# EAGLE design C64_PSU_global (EAGLE 9.5.2)
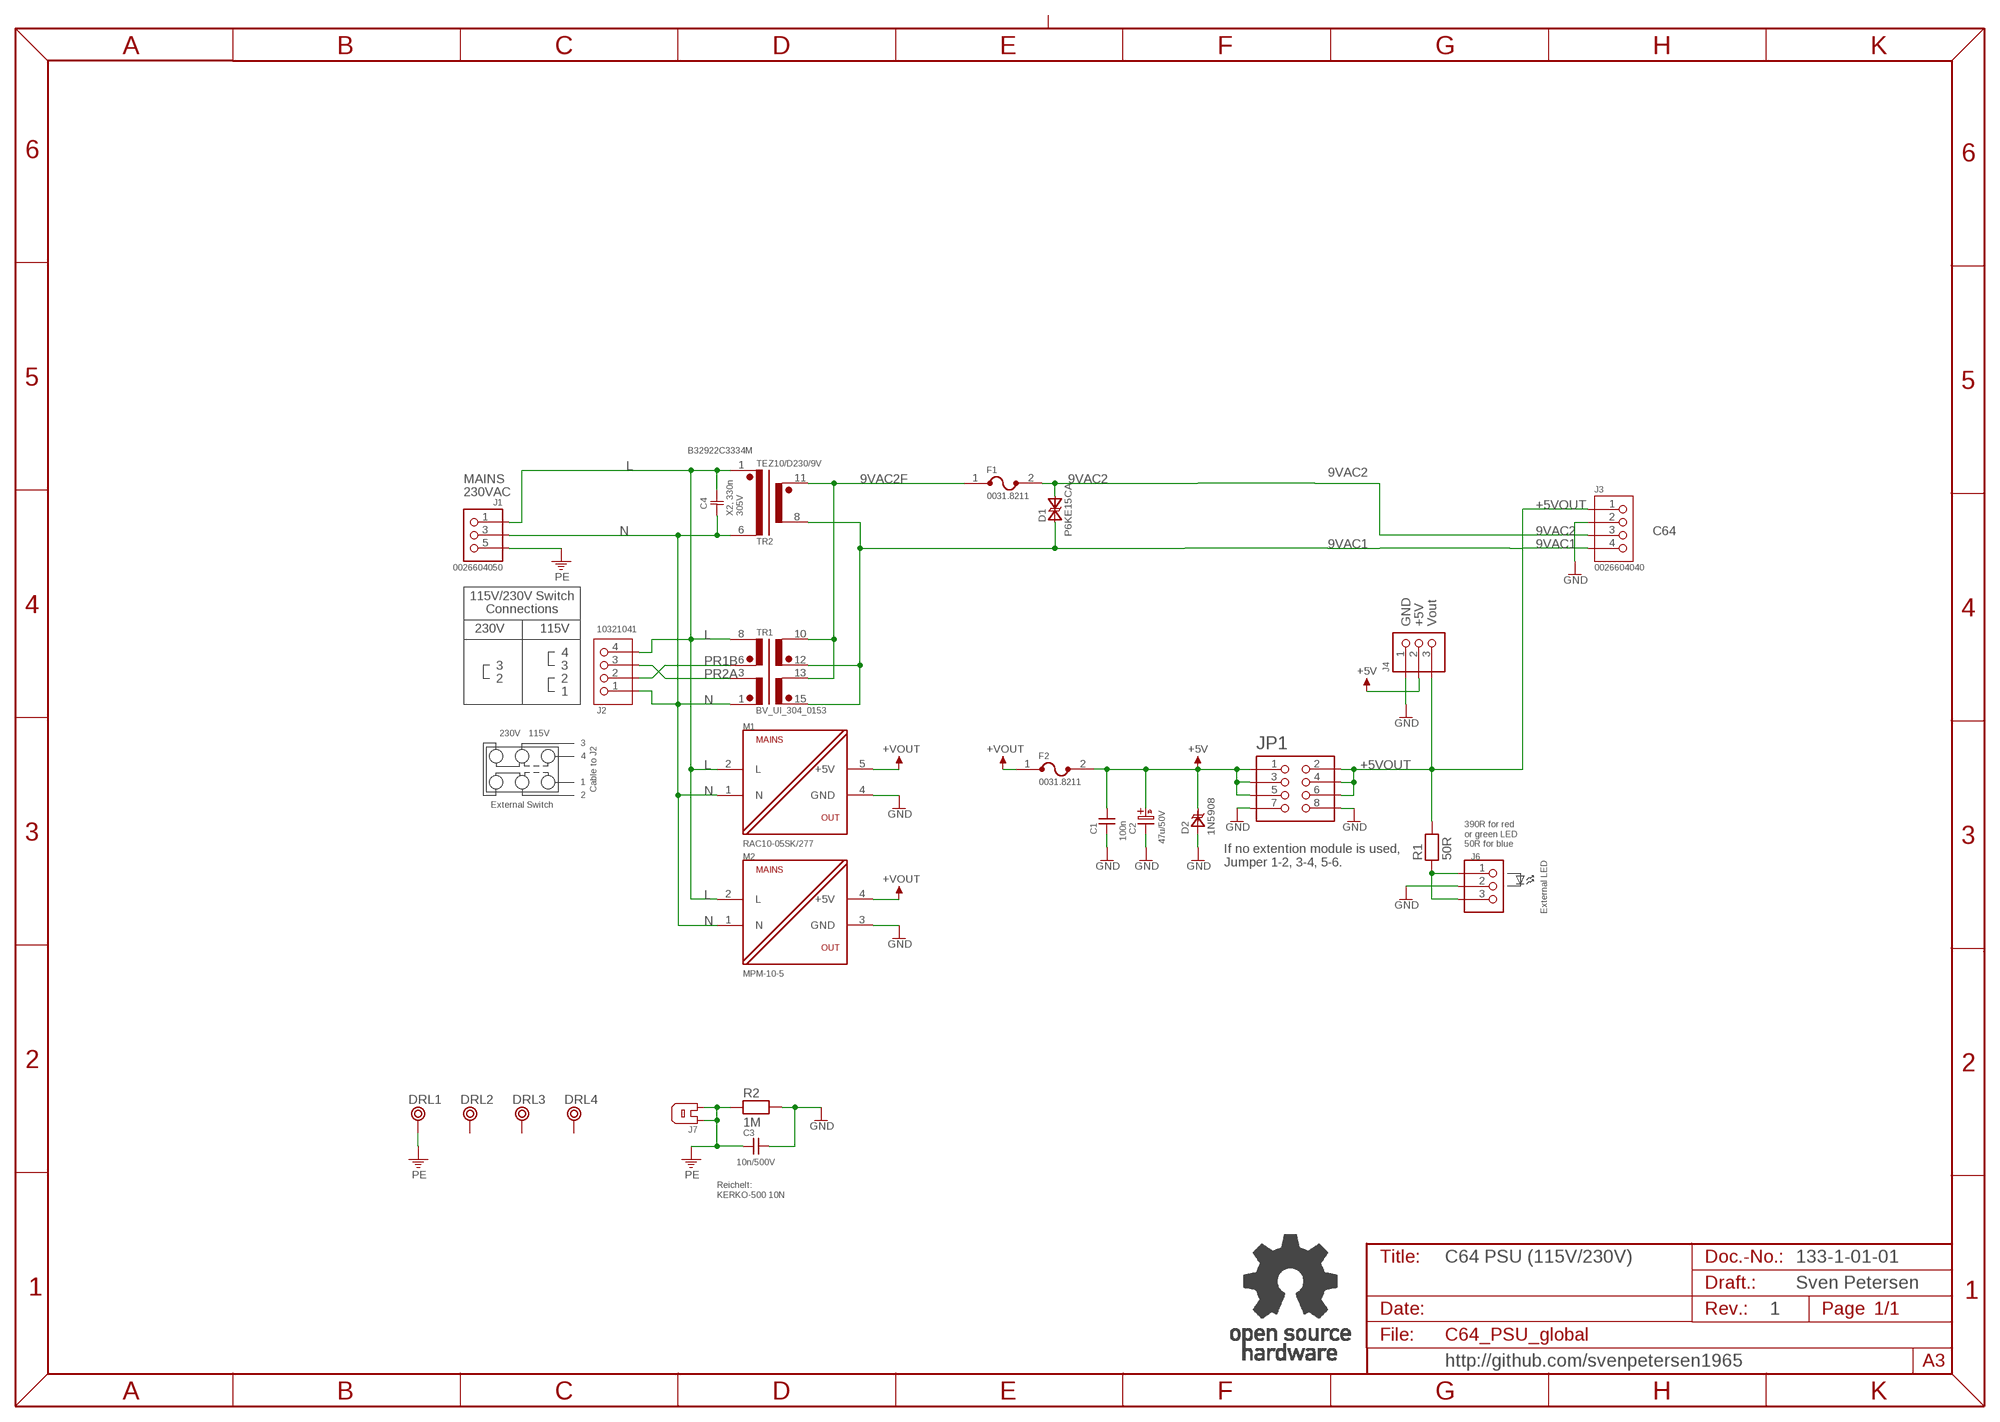
[diagram p0: schematic, sheet 1]

## Parts
C1  100n  CAP01  [C-2,5]
C2  47u/50V  C07/2,5  [C07/2,5]
C3  10n/500V  CAP02  [C-5]
C4  B32922C3334M  X2--RM15-18X8  [C-18X8-RM15]
D1  P6KE15CA  [CB417NP]
D2  1N5908  [CB429]
DRL1  BOHR3,5OR  [BOHR3,5_OHNE_RESTRICT]
DRL2  BOHR3,5  [BOHR3,5]
DRL3  BOHR3,5  [BOHR3,5]
DRL4  BOHR3,5  [BOHR3,5]
F1  0031.8211  [0031.8211]
F2  0031.8211  [0031.8211]
J1  0026604050  0026604050MOD  [SPOX_3.96_5P3]
J2  10321041  [SPOX_5.08_4P]
J3  0026604040  [SPOX_3.96_4P]
J4  6410-3P  [6410-3P]
J6  PINHD-1X3  [1X03]
J7  FLA6,3  [FLA6,3]
JP1  PINHD-2X4  [2X04]
M1  RAC10-05SK/277  [RAC10-K/277]
M2  MPM-10-5  [MPM10]
R1  50R  RES04  [R-10]
R2  1M  RES04  [R-10]
TR1  BV_UI_304_0153  [UI30]
TR2  TEZ10/D230/9V  [TEZ10]
U$25  OPEN_SOURCE_HW  [OPENHW]

## Nets
9VAC1: D1.A(A1) J3.4 TR1.12(SEC1B) TR1.15(SEC2B) TR2.8(SEC11)
9VAC2: D1.K(A2) F1.2 J3.3
9VAC2F: F1.1 TR1.10(SEC1A) TR1.13(SEC2A) TR2.11(SEC12)
+5V: C1.2 C2.A(+) D2.K F2.2 J4.2 JP1.1 JP1.3 JP1.5
+5VOUT: J3.1 J4.3 JP1.2 JP1.4 JP1.6 R1.2
+VOUT: F2.1 M1.5(+5V) M2.4(+5V)
GND: C1.1 C2.K(-) C3.2 D2.A J3.2 J4.1 J6.2 JP1.7 JP1.8 M1.4(GND) M2.3(GND) R2.2
L [mains]: C4.2 J1.1 J2.4 M1.2(L) M2.2(L) TR1.8(PRI1A) TR2.1(PRI2)
N [mains]: C4.1 J1.3 J2.1 M1.1(N) M2.1(N) TR1.1(PRI2B) TR2.6(PRI1)
N$2: J6.1 J6.3 R1.1
PE [PE]: C3.1 DRL1.P$1 J1.5 J7.1 J7.2 R2.1
PR1B [115V]: J2.2 TR1.6(PRI1B)
PR2A [115V]: J2.3 TR1.3(PRI2A)
Unconnected: DRL2.P$1 DRL3.P$1 DRL4.P$1

## Notes on the sheet
- MAINS
- 230VAC
- X2, 330n
  305V
- C64
- 115V/230V Switch
- Connections
- GND | +5V | Vout
- 230V | 115V
- 4
- 3 | 3
- 2 | 2
- 1
- 230V | 115V
- 3
- 4
- Cable to J2
- 1
- 2
- External Switch
- 390R for red
  or green LED
  50R for blue
- If no extention module is used,
  Jumper 1-2, 3-4, 5-6.
- External LED
- Reichelt:
  KERKO-500 10N
- C64 PSU (115V/230V) | 133-1-01-01
- Sven Petersen
- 1
- http://github.com/svenpetersen1965

## Library data of the parts
C1 = DISCRETE:CAP01
C2 = ELCO:C07/2,5
C3 = DISCRETE:CAP02
C4 = Epcos_EMV:X2-*: X2-Kondensatoren
D1 = ST:P6KE15CA
D2 = ST:1N5908
DRL1-DRL4 = Mech_Bohr:BOHR3,5
F1 F2 = Schurter:0031.8211
J1 = MOLEX:0026604050MOD
J2 = MOLEX:10321041
J3 = MOLEX:0026604040
J4 = MOLEX:6410-3P: 6410/22-27-2031
J6 = PINHEAD:PINHD-1X3
J7 = Connect:FLA6,3
JP1 = PINHEAD:PINHD-2X4
M1 = Recom:RAC10-05SK/277
M2 = MeanWell:MPM-10-5
R1 R2 = DISCRETE:RES04
TR1 = Hahn:BV_UI_304_0153
TR2 = Breve Tufvassons:TEZ10/D230/9V: tme.eu: TEZ10/D/9V
U$25 = Logo:OPEN_SOURCE_HW

## Net classes
0 default: clearance 0.152 mm
1 mains: width 1.016 mm, drill 0.6 mm, clearance 1 mm to class 0, clearance 5 mm
2 PE: width 1.016 mm, drill 0.6 mm, clearance 1.5 mm to class 0, clearance 5 mm to class 1
3 115V: width 1.016 mm, drill 0.6 mm, clearance 1 mm to class 0, clearance 2.5 mm to class 1, clearance 5 mm to class 2, clearance 2.5 mm

## Board
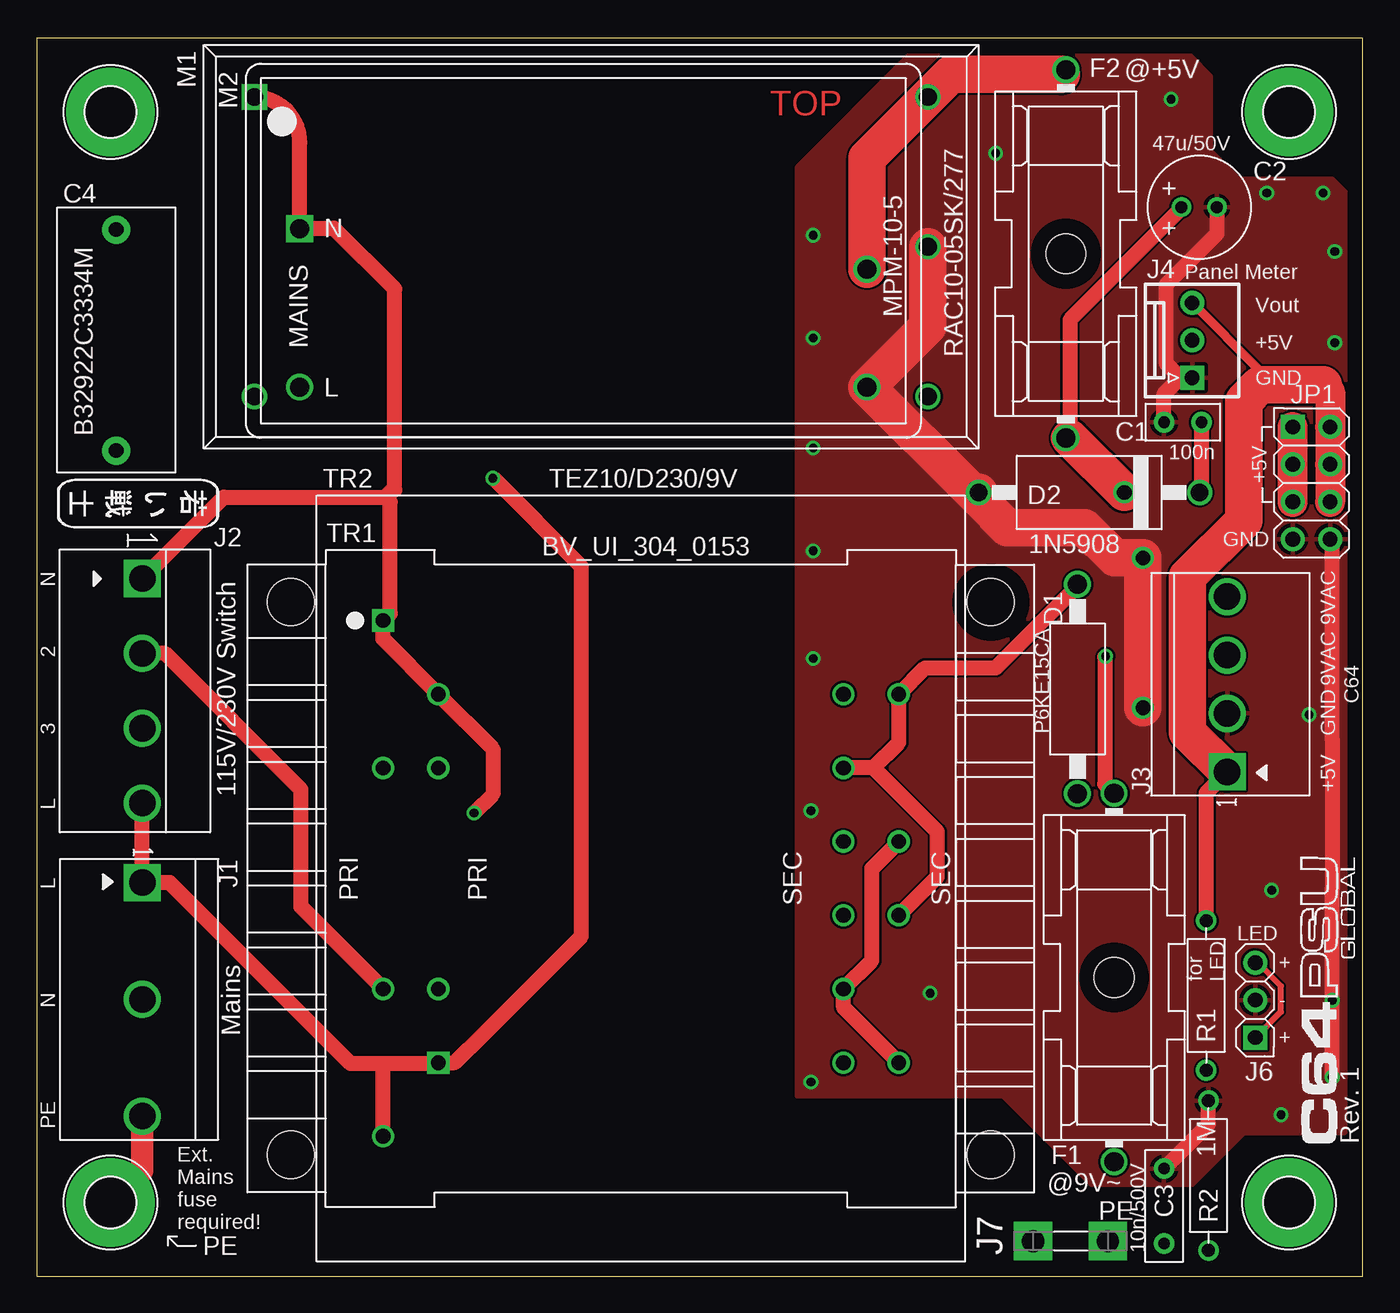
[diagram p1: board, top side]
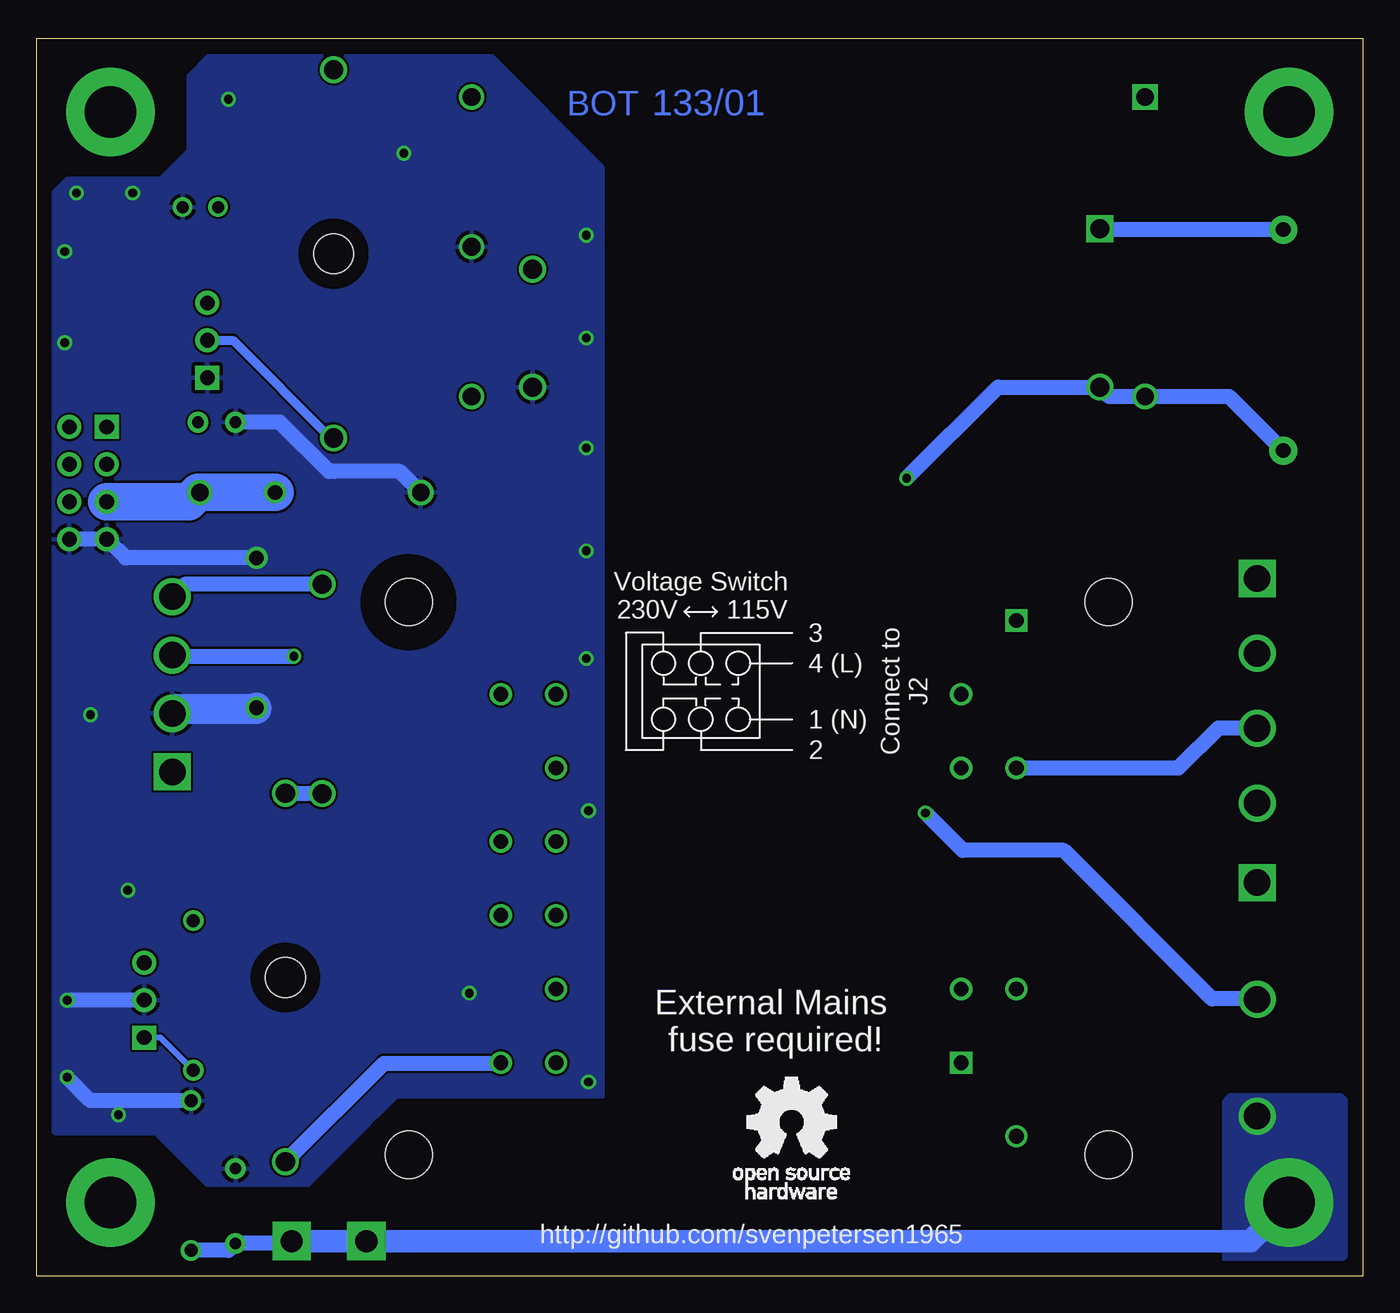
[diagram p2: board, bottom side, seen from below]

Size 90 x 84 mm. Coordinates in mm from the lower left corner, seen from the top.
Outline: 0,0 90,0 90,84 0,84 0,0
Copper layers (1*16): Top 0.035mm / dielectric 1.5mm / Bottom 0.035mm
Design rules "default *": minimum track width 6mil, minimum drill 0.35mm, track to track 6mil, track to pad 6mil, pad to pad 6mil, via to via 6mil, smd to smd 6mil, copper to edge 40mil, drill to drill 6mil, minimum pad ring 10mil, minimum via ring 8mil, stop-mask expansion 4mil, vias tented up to drill 0mil, thermal gap 10mil
tRestrict: 4 lines
bRestrict: 3 lines

### Footprints (pad centres in the part's own frame; a part is rotated, then mirrored left to right if it is on the bottom)
C-2,5 = drill 0.8 pad 1.397: 1 -1.27,0; 2 1.27,0
C07/2,5 = drill 0.813 pad 1.27: A -1.202,0; K 1.202,0
C-5 = drill 0.8 pad 1.397: 1 -2.54,0; 2 2.54,0
C-18X8-RM15 = drill 1 pad 1.905: 1 -7.5,0; 2 7.5,0
CB417NP = drill 1.3: A -7.1,0; K 7.1,0
CB429 = drill 1.2: A -7.5,0; K 7.5,0
BOHR3,5_OHNE_RESTRICT = drill 3.5 pad 6: P$1 0,0
BOHR3,5 = drill 3.5 pad 6: P$1 0,0
0031.8211 = drill 1.3: 1 -12.5,0; 2 12.5,0 | hole 2.7: 0,0
SPOX_3.96_5P3 = drill 1.8 square: 1 -7.92,0 | drill 1.8: 3 0,0; 5 7.92,0
SPOX_5.08_4P = drill 1.8 square: 1 -7.62,0 | drill 1.8: 2 -2.54,0; 3 2.54,0; 4 7.62,0
SPOX_3.96_4P = drill 1.8 square: 1 -5.94,0 | drill 1.8: 2 -1.98,0; 3 1.98,0; 4 5.94,0
6410-3P = drill 1 pad 1.626 square: 1 -2.54,0 | drill 1 pad 1.626: 2 0,0; 3 2.54,0
1X03 = drill 1 pad 1.626 square: 1 -2.54,0 | drill 1 pad 1.626: 2 0,0; 3 2.54,0
FLA6,3 = drill 1.5 pad 2.591 square: 1 -2.54,0; 2 2.54,0
2X04 = drill 1 pad 1.626 square: 1 -3.81,-1.27 | drill 1 pad 1.626: 2 -3.81,1.27; 3 -1.27,-1.27; 4 -1.27,1.27; 5 1.27,-1.27; 6 1.27,1.27; 7 3.81,-1.27; 8 3.81,1.27
RAC10-K/277 = drill 1.2 square: 1 -22.86,10.16 | drill 1.2: 2 -22.86,-10.16; 3 22.86,-10.16; 4 22.86,0; 5 22.86,10.16
MPM10 = drill 1.3 square: 1 -19.25,1.5 | drill 1.3: 2 -19.25,-9.25; 3 19.25,-9.25; 4 19.25,-1.25
R-10 = drill 0.889 pad 1.397: 1 -5.08,0; 2 5.08,0
UI30 = drill 1 square: 1 17.5,17.5 | drill 1: 3 7.5,17.5; 6 -7.5,17.5; 8 -17.5,17.5; 10 -12.5,-17.5; 12 -2.5,-17.5; 13 2.5,-17.5; 15 12.5,-17.5 | hole 3.2: 18.75,-23.75; 18.75,23.75; -18.75,-23.75; -18.75,23.75
TEZ10 = drill 1 square: 1 -12.5,13.75 | drill 1: 2 -7.5,13.75; 5 7.5,13.75; 6 12.5,13.75; 7 12.5,-13.75; 8 7.5,-13.75; 9 2.5,-13.75; 10 -2.5,-13.75; 11 -7.5,-13.75; 12 -12.5,-13.75

### Placement (x,y rotation side)
C1  77.79,57.94 0 top
C2  78.9,72.55 0 top
C3  76.52,4.76 90 top
C4  5.39,63.52 270 top
D1  70.64,39.85 270 top
D2  71.44,53.18 0 top
DRL1  5,5 0 top
DRL2  85,5 0 top
DRL3  85,79 0 top
DRL4  5,79 0 top
F1  73.13,20.26 90 top
F2  69.85,69.37 270 top
J1  7.16,18.78 270 top
J2  7.16,39.72 270 top
J3  80.8,40.16 90 top
J4  78.42,63.5 90 top
J6  82.71,18.73 90 top
J7  70.17,2.38 0 top
JP1  86.52,53.82 270 top
M1  37.63,69.85 0 top
M2  37.1,69.58 0 top
R1  79.38,19.05 90 top
R2  79.53,6.83 90 top
TR1  41.01,26.99 90 top
TR2  41.01,26.99 90 top
U$14  [PCB-TITLE/]  0,96.68 0 top  (outside the outline)
U$20  [SVEN_TAG]  6.99,52.39 270 top
U$22  [C64_PSU_GLOBAL]  89.5,9 90 top
U$23  [2LAYER]  49.75,78.75 0 top
U$25  42.7,5.24 0 bottom

### Tracks (layer width: path | path; a pad name or v marks a point on that pad's centre or on a via)
9VAC1
  Top 1.016: TR1.12 61.12,27.1 61.12,30.16 56.79,34.49 | 56.79,34.49 TR2.8 | 56.79,34.49 58.51,36.2 TR1.15 60.29,41.27 65.09,41.27 70.64,46.83 D1.A
  Bottom 1.016: D1.A 79.96,46.95 J3.4
9VAC2  (via drill 0.6)
  Top 1.016: v72.55,42.07 72.49,42.01 72.49,33.4 F1.2
  Bottom 1.016: D1.K 73.11,32.75 F1.2 | J3.3 80.73,42.07 v72.55,42.07
9VAC2F
  Top 1.016: TR1.10 54.76,18.24 TR2.11 56.67,21.41 56.67,27.66 TR1.13
  Bottom 1.016: F1.1 66.44,14.45 58.55,14.45 TR1.10
+5V  (via drill 1)
  Top 1.016: 70.13,56.87 70.13,64.89 77.7,72.46 C2.A | C1.2 79.06,53.3 D2.K
  Top 2.032: 70.13,56.87 F2.2 | JP1.5 JP1.3 JP1.1
  Top 2.54: v73.82,53.18 70.13,56.87
  Bottom 0.61: J4.2 76.68,63.5 70.05,56.87 F2.2
  Bottom 2.54: v73.82,53.18 D2.K 79.06,53.18 79.69,52.55 JP1.5
+5VOUT
  Top 0.61: J4.3 83.03,61.44 83.03,60.48
  Top 1.016: R1.2 79.38,32.8 J3.1
  Top 2.032: 87.31,60.48 87.79,60.01 JP1.2 JP1.4 JP1.6
  Top 2.54: J3.1 78.11,36.92 78.11,47.47 81.92,51.28 81.92,57.94 81.92,59.37 83.03,60.48 87.31,60.48
+VOUT
  Top 1.524: 69.53,81.56 F2.1
  Top 2.54: M2.4 56.35,75.87 M1.5 62.04,81.56 69.53,81.56
GND  (via drill 0.6, 1)
  Top 1.016: D2.A 63.5,53.18 | 87.95,49.85 87.95,36.35 87.95,30.32 87.95,26.35 v87.95,18.73 v87.95,13.49 | C3.2 79.53,10.32 R2.2 | C2.K 80.1,70.73 76.68,67.31 76.68,61.91 77.63,60.96 | C1.1 76.52,59.85 77.63,60.96 | J4.1 77.63,60.96
  Top 2.54: M1.4 60.49,64.47 M2.3 63.5,53.18 | v75.09,38.58 v75.09,48.74 73.18,48.74 71.12,50.8 65.88,50.8 63.94,52.74 D2.A
  Bottom 1.016: D2.A 65.37,54.61 69.85,54.61 70.17,54.61 73.5,57.94 C1.1 | R2.2 86.36,11.91 v87.95,13.49 | J6.2 v87.95,18.73 | v75.09,48.74 83.98,48.74 JP1.7 JP1.8
  Bottom 2.032: J3.2 80.49,38.5 75.09,38.5 v75.09,38.58
  other vias: 83.5,73.5 87.31,73.5 88.11,69.53 88.11,63.34 86.36,38.1 83.82,26.19 84.45,10.95 60.64,19.21 52.55,13.18 52.55,31.59 52.7,41.91 52.7,49.21 52.7,56.2 52.7,63.66 52.7,70.64 76.99,79.85 65.09,76.2
  pour Bottom: 59.21,82.87 51.59,75.25 51.59,12.22 65.56,12.22 71.6,6.19 78.42,6.19 81.92,9.68 88.74,9.68 89.53,10.48 89.53,72.87 88.42,73.98 87.95,74.45 81.6,74.45 79.69,76.36 79.69,81.44 78.26,82.87
  pour Top: 51.59,75.25 51.59,12.22 65.56,12.22 71.6,6.19 78.42,6.19 81.92,9.68 88.74,9.68 89.53,10.48 89.53,72.87 87.95,74.45 81.6,74.45 79.69,76.36 79.69,81.44 78.26,82.87 59.21,82.87
L  (via drill 0.6)
  Top 1.016: v30.96,54.13 30.99,54.13 36.97,48.15 36.97,23.07 30.3,16.4 30.28,16.4 28.37,14.49 TR2.1 27.21,14.45 23.5,14.45 | 23.5,14.45 21.27,14.45 9.02,26.7 J1.1 J2.4 | TR1.8 23.5,14.44 23.5,14.45
  Bottom 1.016: C4.2 9.06,59.69 M1.2 17.21,59.69 M2.2 24.76,60.33 v30.96,54.13
N  (via drill 0.6)
  Top 1.016: M1.1 arc-90 17.85,76.93 M2.1 20.12,71.08 20.16,71.12 24.29,66.99 24.29,53.34 24.13,53.34 23.65,52.86 | 23.65,52.86 12.68,52.86 J2.1 | v29.69,31.43 30.96,32.7 30.96,35.79 TR2.6 23.5,43.24 TR1.1 23.98,44.96 23.98,52.54 23.65,52.86
  Bottom 1.016: C4.1 17.79,71.02 arc90 M2.1 | J1.3 7.2,18.82 10.22,18.82 20.3,28.89 27.15,28.89 v29.69,31.43
N$2
  Top 0.406: J6.1 84.45,17.94 84.45,19.68 82.87,21.27 J6.3
  Bottom 0.406: R1.1 81.6,16.19 J6.1
PE
  Top 1.524: DRL1.P$1 7.16,7.16 J1.5
  Bottom 1.016: J7.2 72.87,2.22 C3.1 76.99,1.75 R2.1
  Bottom 1.524: DRL1.P$1 7.62,2.38 J7.1 J7.2
  pour Bottom (no thermals): 8.89,0.79 2.22,0.79 1.11,1.91 1.11,11.43 1.59,11.91 8.89,11.91 9.05,11.75 9.05,1.11 8.89,0.95
PR1B
  Top 1.016: TR1.6 17.94,25.05 17.94,33.02 8.7,42.26 J2.2
PR2A
  Bottom 1.016: TR1.3 12.5,34.49 9.81,37.18 J2.3

### Text on the board
Bottom: 133/01
tPlace: @+5V | 47u/50V | B32922C3334M | Panel Meter | Vout | MPM-10-5 | +5V | RAC10-05SK/277 | GND | 100n | +5V | TEZ10/D230/9V | GND | BV_UI_304_0153 | 1N5908 | N | 9VAC | 2 | 9VAC | 115V/230V Switch | C64 | GND | 3 | P6KE15CA | +5V | L | L | LED | + | for / LED | N | Mains | - | + | PE | Rev. 1 | 1M | @9V~ | PE | Ext. / Mains / fuse / required! | PE | 10n/500V
bPlace: Voltage Switch | 115V | 230V | 3 | 4 (L) | Connect to / J2 | 1 (N) | 2 | External Mains / fuse required! | http://github.com/svenpetersen1965
Measures: 4- 3.5
Document: Sven Petersen | 133-1-01-01 | 2020 | 35µm | 2 | 1
tDocu: bi- / directional